# Altium schematic sheet Schematic.SchDoc
size A4; Organization: Altium Limited; Address1: L3, 12a Rodborough Rd; Address2: Frenchs Forest; Address3: NSW; Address4: Australia 2086
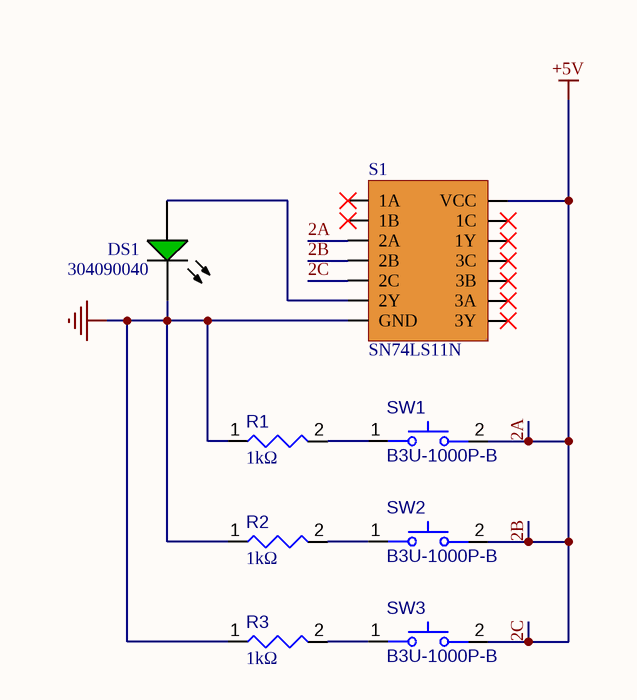
[diagram p0: Schematic.SchDoc]

## Parts
DS1  304090040  [LED-2P-2.28-3MM]
R1  value 1kΩ  [RESC0402(1005)_L]  (hidden comment: 1KR2J)
R2  value 1kΩ  [RESC0402(1005)_L]  (hidden comment: 1KR2J)
R3  value 1kΩ  [RESC0402(1005)_L]  (hidden comment: 1KR2J)
S1  SN74LS11N
SW1  B3U-1000P-B  [OMRON-B3U-1000P-2-B_V]
SW2  B3U-1000P-B  [OMRON-B3U-1000P-2-B_V]
SW3  B3U-1000P-B  [OMRON-B3U-1000P-2-B_V]

## Nets
2A: S1.3(2A) S1.4(2B) S1.5(2C) S1.14(VCC) SW1.2 SW2.2 SW3.2  [also labelled +5V, 2B, 2C]
GND: DS1.2(K) R1.1 R2.1 R3.1 S1.7(GND)
NetDS1_1: DS1.1(A) S1.6(2Y)
NetR1_2: R1.2 SW1.1
NetR2_2: R2.2 SW2.1
NetR3_2: R3.2 SW3.1

Not connected (* = marked no-connect by the designer): S1 1(1A)* 2(1B)* 8(3Y)* 9(3A)* 10(3B)* 11(3C)* 12(1Y)* 13(1C)*

## Notes on the sheet
- Title
- Size:
- Date:
- A4
- Number:
- Time:
- Revision:
- Sheet
- of
- File:

## Library data of the parts
DS1 = CMP-007-00006-1: Green LED, 80 mW, 20 mA, -25 to 85 degC, 2-Pin THD; Manufacturer: Shenzhen CGX; Mounting Technology: TH; Case/Package: 304090040; Package Description: 2-Pin Through Hole Device, Dia 3 mm, Pitch 2.28 mm; RoHS Compliant: Unknown; Package Reference: 304090040; Datasheet Version: Rev. 1.0, 09/2014; Manufacturer URL: http://szcgx.com/; Datasheet URL: http://datasheet.octopart.com/304090040-Chengguangxing-datasheet-62330655.pdf
R1-R3 = CMP-009-00075-1: 1K 0.063W 5% 0402 (1005 Metric)  SMD; Power: 63mW; Pins: 2; Mounting Technology: SMT; Tolerance: 5%; Case/Package: 0402
S1 = SN74LS11N: AND Gate 3-Element 3-IN Bipolar 14-Pin PDIP Tube; Manufacturer: Texas Instruments; Propagation Delay: 20ns; Output Current: 8mA; Number of Gates: 3; Quiescent Current: 3.3mA; Operating Supply Voltage: 5V; Number of Outputs: 1; Max Supply Voltage: 5.25V; Min Supply Voltage: 4.75V; High Level Output Current: -400uA; Schmitt Trigger Input: No; Supplier 1: Digi-Key; Manufacturer Part Number: SN74LS11N; RoHS: Yes; Category: Logic Gates; Stock 1: 479; Pricing 1: 1=0.84000, 10=0.73800, 25=0.69320, 100=0.56590, 250=0.52560, 500=0.44732, 1000=0.35786, 2500=0.32431, 5000=0.30194 (USD); Mount: Through Hole; Case/Package: PDIP; Number of Pins: 14; Weight: 0.032734oz; Min Operating Temperature: 0°C; Max Operating Temperature: 70°C; Packaging: Rail/Tube; Number of Circuits: 3; Number of Bits: 3; Package Quantity: 25; Number of Inputs: 3; Logic Function: AND GATE; Max Output Current: 8mA; Number of Elements: 3; Number of Input Lines: 3; Number of Output Lines: 1; Low Level Output Current: 8mA; Turn-On Delay Time: 20ns; Termination: Through Hole; Length: 19.3mm; Width: 6.35mm; Height: 4.57mm; Radiation Hardening: No; REACH SVHC: No SVHC; Lead Free: Lead Free; RoHS Compliant: Yes; ComponentLink1URL: https://datasheet.ciiva.com/15090/getdatasheetpartid-48969-15090244.pdf?src-supplier=Verical; ComponentLink1Description: https://datasheet.ciiva.com/15090/getdatasheetpartid-48969-15090244.pdf?src-supplier=Verical; ComponentLink2URL: https://datasheet.ciiva.com/14134/jb645521-e-14134400.pdf?src-supplier=Distrelec; ComponentLink2Description: https://datasheet.ciiva.com/14134/jb645521-e-14134400.pdf?src-supplier=Distrelec; ComponentLink3URL: https://datasheet.ciiva.com/14666/0900766b800a3f35-14666841.pdf?src-supplier=RSComponents; ComponentLink3Description: https://datasheet.ciiva.com/14666/0900766b800a3f35-14666841.pdf?src-supplier=RSComponents; ComponentLink4URL: https://datasheet.ciiva.com/41456/001016884-da-01-en-ic-trp-3in-and-g-s-sn74ls11n-pdip-14-tid-41456520.pdf?src-supplier=Conrad; ComponentLink4Description: https://datasheet.ciiva.com/41456/001016884-da-01-en-ic-trp-3in-and-g-s-sn74ls11n-pdip-14-tid-41456520.pdf?src-supplier=Conrad; ComponentLink5URL: https://datasheet.ciiva.com/26242/sn54ls11-26242885.pdf?src-supplier=Avnet+Europe; ComponentLink5Description: https://datasheet.ciiva.com/26242/sn54ls11-26242885.pdf?src-supplier=Avnet+Europe; ComponentLink6URL: https://datasheet.ciiva.com/7783/1767254-7783079.pdf?src-supplier=Element14; ComponentLink6Description: https://datasheet.ciiva.com/7783/1767254-7783079.pdf?src-supplier=Element14; ComponentLink7URL: https://datasheet.ciiva.com/14290/sn54ls11-14290796.pdf?src-supplier=Avnet; ComponentLink7Description: https://datasheet.ciiva.com/14290/sn54ls11-14290796.pdf?src-supplier=Avnet; Supplier Part Number 1: 296-3638-ND
SW1-SW3 = CMP-011-00011-1: Ultra-small Surface-mounting Tactile Switches with High Contact Reliability, SPST-NO, -25 to 70 degC, 2-Pin SMD, RoHS, Tape and Reel; Current Rating: 50mA; Voltage Rating: 12V; RoHS Compliant: Details; Pins: 2